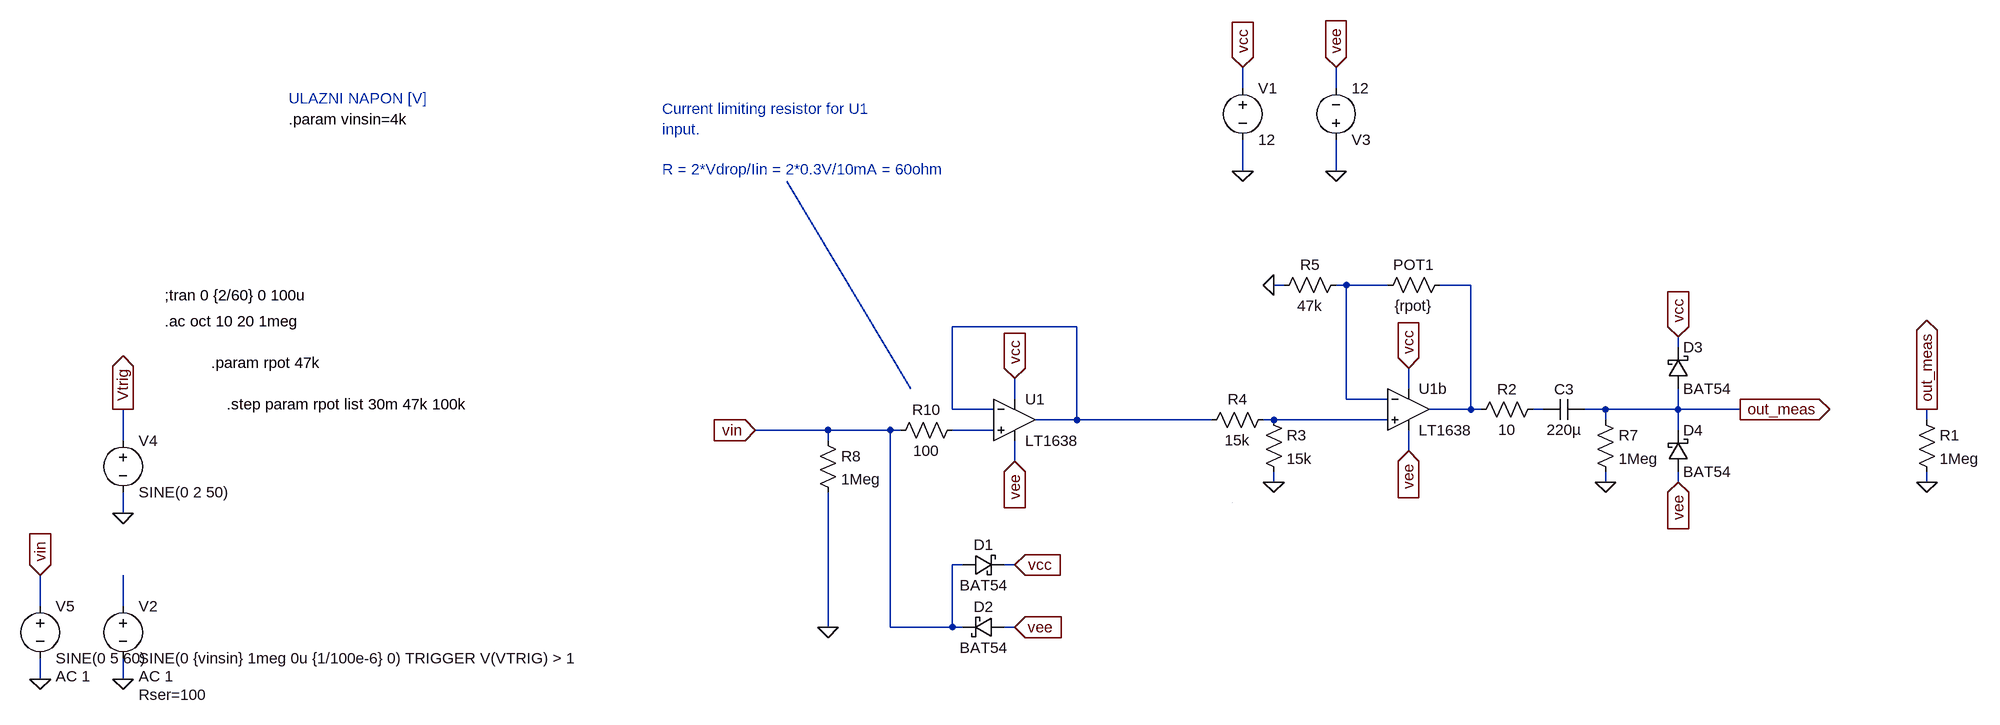
[diagram p0: schematic DC-DC G&W_analog_v2.asc]
DC-DC G&W_analog_v2.asc, the LTspice schematic file:
Version 4
SHEET 1 3704 2568
WIRE 2464 1520 2464 1488
WIRE 2608 1520 2608 1488
WIRE 2464 1648 2464 1600
WIRE 2608 1648 2608 1600
WIRE 2528 1824 2512 1824
WIRE 2624 1824 2608 1824
WIRE 2688 1824 2624 1824
WIRE 2816 1824 2768 1824
WIRE 2208 1888 2016 1888
WIRE 3136 1920 3136 1904
WIRE 2720 1984 2720 1952
WIRE 2112 2000 2112 1968
WIRE 2624 2000 2624 1824
WIRE 2688 2000 2624 2000
WIRE 2016 2016 2016 1888
WIRE 2080 2016 2016 2016
WIRE 2816 2016 2816 1824
WIRE 2816 2016 2752 2016
WIRE 2832 2016 2816 2016
WIRE 2928 2016 2912 2016
WIRE 3024 2016 2992 2016
WIRE 3136 2016 3136 1984
WIRE 3136 2016 3024 2016
WIRE 3232 2016 3136 2016
WIRE 2208 2032 2208 1888
WIRE 2208 2032 2144 2032
WIRE 2416 2032 2208 2032
WIRE 2512 2032 2496 2032
WIRE 2688 2032 2512 2032
WIRE 3024 2032 3024 2016
WIRE 3520 2032 3520 2016
WIRE 1824 2048 1712 2048
WIRE 1920 2048 1824 2048
WIRE 1936 2048 1920 2048
WIRE 2080 2048 2016 2048
WIRE 3136 2048 3136 2016
WIRE 736 2064 736 2016
WIRE 1824 2064 1824 2048
WIRE 2720 2080 2720 2048
WIRE 2112 2096 2112 2064
WIRE 2512 2128 2512 2112
WIRE 3024 2128 3024 2112
WIRE 3136 2128 3136 2112
WIRE 3520 2128 3520 2112
WIRE 736 2176 736 2144
WIRE 2032 2256 2016 2256
WIRE 2112 2256 2096 2256
WIRE 608 2320 608 2272
WIRE 736 2320 736 2272
WIRE 1824 2352 1824 2144
WIRE 1920 2352 1920 2048
WIRE 2016 2352 2016 2256
WIRE 2016 2352 1920 2352
WIRE 2032 2352 2016 2352
WIRE 2112 2352 2096 2352
WIRE 608 2432 608 2400
WIRE 736 2432 736 2400
FLAG 2112 1968 vcc
IOPIN 2112 1968 In
FLAG 2112 2096 vee
IOPIN 2112 2096 In
FLAG 2512 1824 0
FLAG 2720 1952 vcc
IOPIN 2720 1952 In
FLAG 2720 2080 vee
IOPIN 2720 2080 In
FLAG 2464 1488 vcc
IOPIN 2464 1488 In
FLAG 2608 1488 vee
IOPIN 2608 1488 In
FLAG 736 2432 0
FLAG 3232 2016 out_meas
IOPIN 3232 2016 Out
FLAG 3024 2128 0
FLAG 2464 1648 0
FLAG 2608 1648 0
FLAG 2112 2256 vcc
IOPIN 2112 2256 In
FLAG 2112 2352 vee
IOPIN 2112 2352 In
FLAG 1824 2352 0
FLAG 736 2176 0
FLAG 736 2016 Vtrig
IOPIN 736 2016 Out
FLAG 608 2432 0
FLAG 1712 2048 vin
IOPIN 1712 2048 In
FLAG 2512 2128 0
FLAG 3136 1904 vcc
IOPIN 3136 1904 In
FLAG 3136 2128 vee
IOPIN 3136 2128 In
FLAG 3520 2016 out_meas
IOPIN 3520 2016 Out
FLAG 3520 2128 0
FLAG 608 2272 vin
IOPIN 608 2272 In
SYMBOL res 2512 2016 R90
WINDOW 0 0 56 VBottom 2
WINDOW 3 32 56 VTop 2
SYMATTR InstName R4
SYMATTR Value 15k
SYMBOL res 2624 1808 R90
WINDOW 0 0 56 VBottom 2
WINDOW 3 32 56 VTop 2
SYMATTR InstName R5
SYMATTR Value 47k
SYMBOL res 2784 1808 R90
WINDOW 0 0 56 VBottom 2
WINDOW 3 32 56 VTop 2
SYMATTR InstName POT1
SYMATTR Value {rpot}
SYMBOL voltage 736 2304 R0
WINDOW 123 24 124 Left 2
WINDOW 39 24 152 Left 2
SYMATTR Value2 AC 1
SYMATTR SpiceLine Rser=100
SYMATTR InstName V2
SYMATTR Value SINE(0 {vinsin} 1meg 0u {1/100e-6} 0) TRIGGER V(VTRIG) > 1
SYMBOL cap 2992 2000 R90
WINDOW 0 0 32 VBottom 2
WINDOW 3 32 32 VTop 2
SYMATTR InstName C3
SYMATTR Value 220µ
SYMBOL res 3008 2016 R0
SYMATTR InstName R7
SYMATTR Value 1Meg
SYMBOL voltage 2464 1504 R0
WINDOW 123 0 0 Left 2
SYMATTR InstName V1
SYMATTR Value 12
SYMATTR SpiceLine Rser=10m
SYMBOL voltage 2608 1616 M180
WINDOW 123 0 0 Left 2
SYMATTR InstName V3
SYMATTR Value 12
SYMATTR SpiceLine Rser=10m
SYMBOL res 2928 2000 R90
WINDOW 0 0 56 VBottom 2
WINDOW 3 32 56 VTop 2
SYMATTR InstName R2
SYMATTR Value 10
SYMBOL schottky 2032 2272 R270
WINDOW 0 32 32 VTop 2
WINDOW 3 0 32 VBottom 2
SYMATTR InstName D1
SYMATTR Value BAT54
SYMATTR Description Diode
SYMATTR Type diode
SYMBOL schottky 2096 2336 R90
WINDOW 0 0 32 VBottom 2
WINDOW 3 32 32 VTop 2
SYMATTR InstName D2
SYMATTR Value BAT54
SYMATTR Description Diode
SYMATTR Type diode
SYMBOL res 1808 2048 R0
SYMATTR InstName R8
SYMATTR Value 1Meg
SYMBOL voltage 736 2048 R0
WINDOW 123 0 0 Left 2
WINDOW 39 0 0 Left 2
SYMATTR InstName V4
SYMATTR Value SINE(0 2 50)
SYMBOL res 2032 2032 R90
WINDOW 0 0 56 VBottom 2
WINDOW 3 32 56 VTop 2
SYMATTR InstName R10
SYMATTR Value 100
SYMBOL voltage 608 2304 R0
WINDOW 123 24 124 Left 2
WINDOW 39 0 0 Left 2
SYMATTR Value2 AC 1
SYMATTR InstName V5
SYMATTR Value SINE(0 5 60)
SYMBOL res 2496 2016 R0
SYMATTR InstName R3
SYMATTR Value 15k
SYMBOL schottky 3120 1984 M180
WINDOW 0 24 64 Left 2
WINDOW 3 24 0 Left 2
SYMATTR InstName D3
SYMATTR Value BAT54
SYMATTR Description Diode
SYMATTR Type diode
SYMBOL schottky 3120 2112 M180
WINDOW 0 24 64 Left 2
WINDOW 3 24 0 Left 2
SYMATTR InstName D4
SYMATTR Value BAT54
SYMATTR Description Diode
SYMATTR Type diode
SYMBOL res 3504 2016 R0
SYMATTR InstName R1
SYMATTR Value 1Meg
SYMBOL Opamps\\LT1638 2112 1968 R0
SYMATTR InstName U1
SYMBOL Opamps\\LT1638 2720 1952 R0
SYMATTR InstName U1b
TEXT 800 1840 Left 2 !;tran 0 {2/60} 0 100u
TEXT 800 1880 Left 2 !.ac oct 10 20 1meg
TEXT 992 1568 Left 2 !.param vinsin=4k
TEXT 992 1536 Left 2 ;ULAZNI NAPON [V]
TEXT 1568 1552 Left 2 ;Current limiting resistor for U1\ninput.\n \nR = 2*Vdrop/Iin = 2*0.3V/10mA = 60ohm
TEXT 872 1944 Left 2 !.param rpot 47k
TEXT 896 2008 Left 2 !.step param rpot list 30m 47k 100k
LINE Normal 2448 2160 2448 2160 2
LINE Normal 2448 2160 2448 2160 2
LINE Normal 1952 1984 1760 1664

The netlist it stands for:
* DC-DC G&W_analog_v2.asc
R4 N005 N003 15k
R5 N001 0 47k
R§POT1 N002 N001 {rpot}
V2 N007 0 SINE(0 {vinsin} 1meg 0u {1/100e-6} 0) TRIGGER V(VTRIG) > 1 AC 1 Rser=100
C3 out_meas N004 220µ
R7 out_meas 0 1Meg
V1 vcc 0 12 Rser=10m
V3 0 vee 12 Rser=10m
R2 N004 N002 10
D1 vin vcc BAT54
D2 vee vin BAT54
R8 vin 0 1Meg
V4 Vtrig 0 SINE(0 2 50)
R10 N006 vin 100
V5 vin 0 SINE(0 5 60) AC 1
R3 N005 0 15k
D3 out_meas vcc BAT54
D4 vee out_meas BAT54
R1 out_meas 0 1Meg
XU1 N006 N003 vcc vee N003 LT1638  ; pins In+ In- V+ V- OUT
XU1b N005 N001 vcc vee N002 LT1638  ; pins In+ In- V+ V- OUT
.model D D
.lib standard.dio
;tran 0 {2/60} 0 100u
.ac oct 10 20 1meg
.param vinsin=4k
* ULAZNI NAPON [V]
* Current limiting resistor for U1
* input.
* R = 2*Vdrop/Iin = 2*0.3V/10mA = 60ohm
.param rpot 47k
.step param rpot list 30m 47k 100k
.backanno
.end